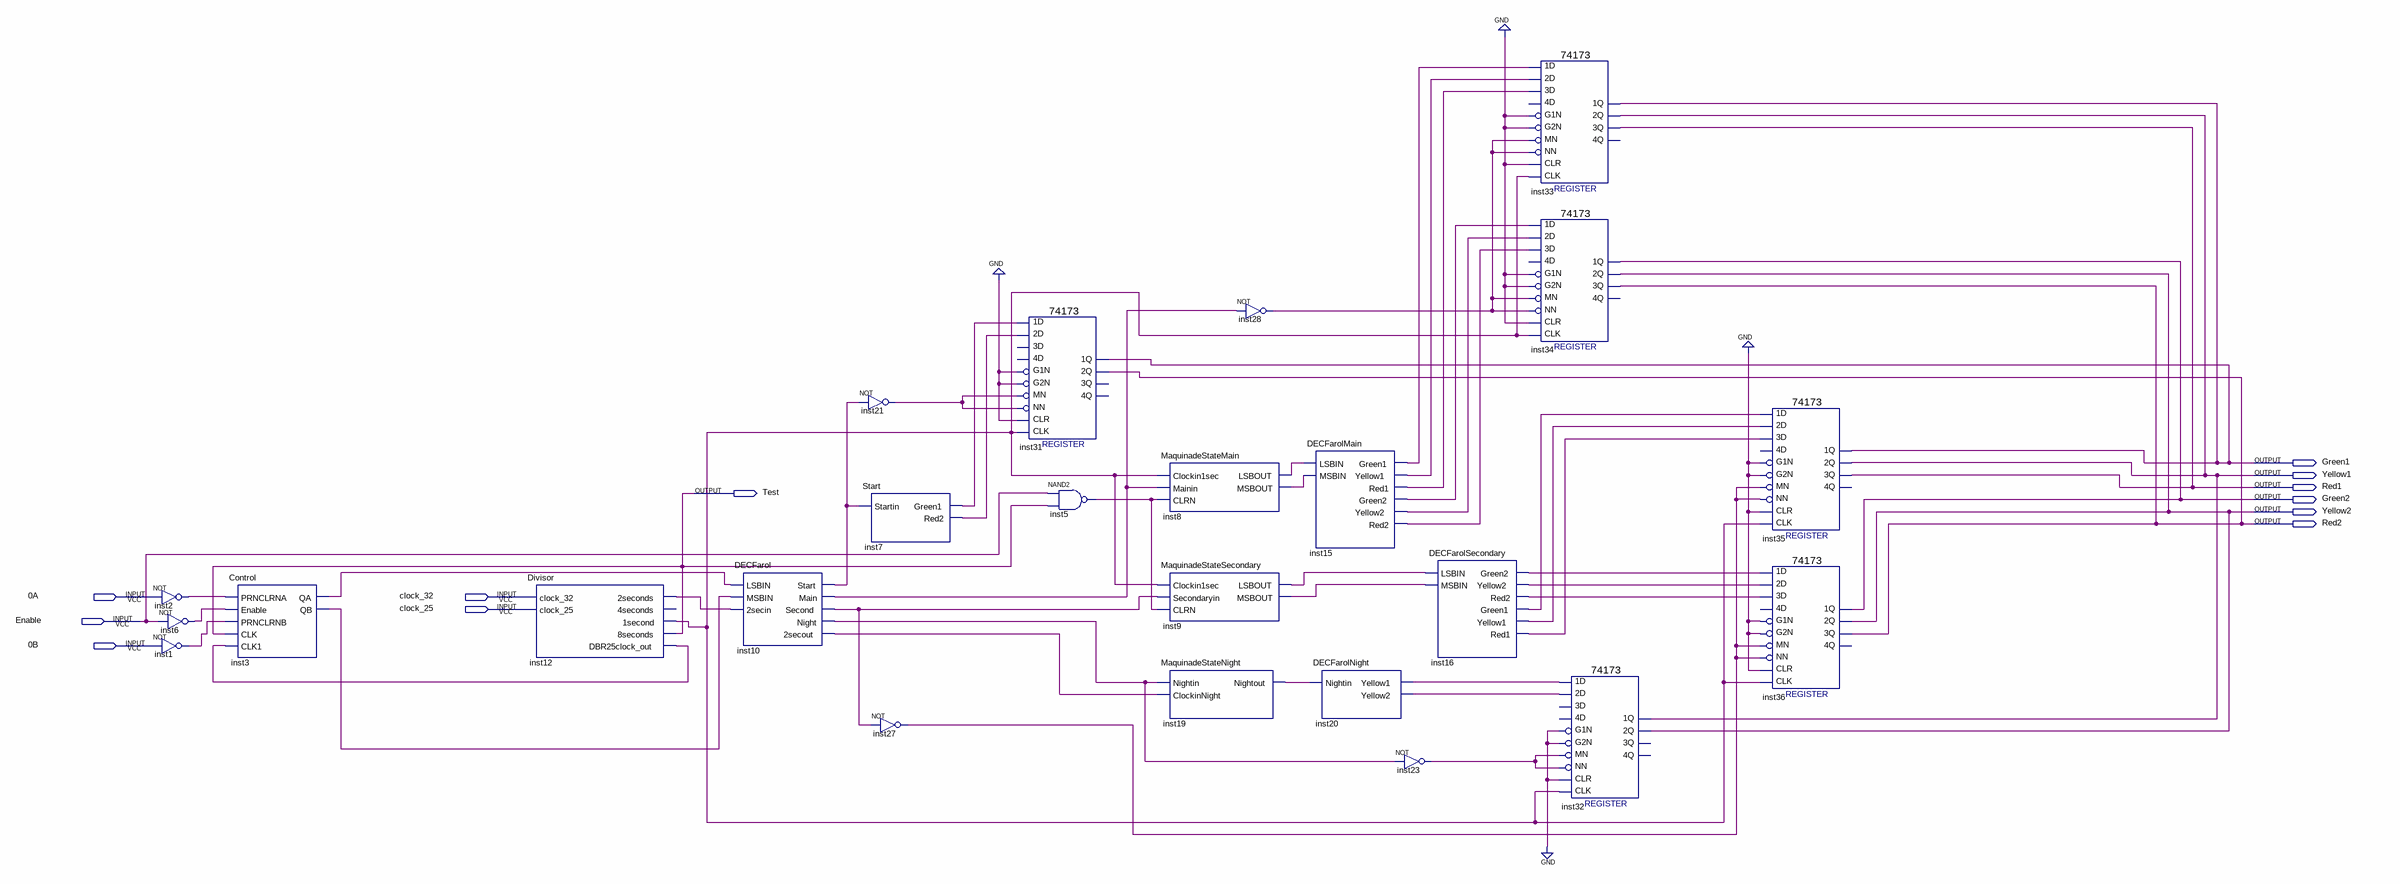
[diagram p0: schematic sheet]
// Quartus schematic SemaforoInteligente.bdf as structural Verilog: 24 symbols, 12 pins
module SemaforoInteligente (
  input  \0A ,
  input  clock_32,
  input  clock_25,
  input  Enable,
  input  \0B ,
  output Green1,
  output Yellow1,
  output Red1,
  output Test,
  output Green2,
  output Yellow2,
  output Red2
);

  wire inst1_out, inst2_out, inst3_qa, inst3_qb, inst5_out, inst6_out, inst7_green1, inst7_red2,
       inst8_lsbout, inst8_msbout, inst9_lsbout, inst9_msbout, inst10_2secout, inst10_main, inst10_night,
       inst10_second, inst10_start, inst12_1second, inst12_2seconds, inst12_dbr25clock_out, inst15_green1,
       inst15_green2, inst15_red1, inst15_red2, inst15_yellow1, inst15_yellow2, inst16_green1, inst16_green2,
       inst16_red1, inst16_red2, inst16_yellow1, inst16_yellow2, inst19_nightout, inst20_yellow1,
       inst20_yellow2, inst21_out, inst23_out, inst27_out, inst28_out;

  not inst2 (inst2_out, \0A );
  not inst6 (inst6_out, Enable);
  not inst1 (inst1_out, \0B );
  Control inst3 (
    .PRNCLRNA(inst2_out), .Enable(inst6_out), .PRNCLRNB(inst1_out), .CLK(Test), .CLK1(inst12_dbr25clock_out),
    .QA(inst3_qa), .QB(inst3_qb));
  Divisor inst12 (
    .clock_32(clock_32), .clock_25(clock_25), .\2seconds (inst12_2seconds), .\1second (inst12_1second),
    .\8seconds (Test), .DBR25clock_out(inst12_dbr25clock_out));  // open: 4seconds
  DECFarol inst10 (
    .LSBIN(inst3_qa), .MSBIN(inst3_qb), .\2secin (inst12_2seconds), .Start(inst10_start), .Main(inst10_main),
    .Second(inst10_second), .Night(inst10_night), .\2secout (inst10_2secout));
  not inst21 (inst21_out, inst10_start);
  Start inst7 (.Startin(inst10_start), .Green1(inst7_green1), .Red2(inst7_red2));
  not inst27 (inst27_out, inst10_second);
  \74173  inst31 (
    .MN(inst21_out), .\1D (inst7_green1), .\2D (inst7_red2), .G1N(1'b0), .G2N(1'b0), .NN(inst21_out),
    .CLR(1'b0), .CLK(inst12_1second), .\2Q (Red2), .\1Q (Green1));  // open: 3D, 4D, 3Q, 4Q
  nand inst5 (inst5_out, Enable, Test);
  MaquinadeStateMain inst8 (
    .Clockin1sec(inst12_1second), .Mainin(inst10_main), .CLRN(inst5_out), .LSBOUT(inst8_lsbout),
    .MSBOUT(inst8_msbout));
  MaquinadeStateSecondary inst9 (
    .Clockin1sec(inst12_1second), .Secondaryin(inst10_second), .CLRN(inst5_out), .LSBOUT(inst9_lsbout),
    .MSBOUT(inst9_msbout));
  MaquinadeStateNight inst19 (.Nightin(inst10_night), .ClockinNight(inst10_2secout), .Nightout(inst19_nightout));
  not inst28 (inst28_out, inst10_main);
  DECFarolMain inst15 (
    .LSBIN(inst8_lsbout), .MSBIN(inst8_msbout), .Green1(inst15_green1), .Yellow1(inst15_yellow1),
    .Red1(inst15_red1), .Green2(inst15_green2), .Yellow2(inst15_yellow2), .Red2(inst15_red2));
  DECFarolNight inst20 (.Nightin(inst19_nightout), .Yellow1(inst20_yellow1), .Yellow2(inst20_yellow2));
  not inst23 (inst23_out, inst10_night);
  DECFarolSecondary inst16 (
    .LSBIN(inst9_lsbout), .MSBIN(inst9_msbout), .Green2(inst16_green2), .Yellow2(inst16_yellow2),
    .Red2(inst16_red2), .Green1(inst16_green1), .Yellow1(inst16_yellow1), .Red1(inst16_red1));
  \74173  inst33 (
    .\3D (inst15_red1), .MN(inst28_out), .\1D (inst15_green1), .\2D (inst15_yellow1), .G1N(1'b0), .G2N(1'b0),
    .NN(inst28_out), .CLR(1'b0), .CLK(inst12_1second), .\3Q (Red1), .\2Q (Yellow1), .\1Q (Green1));  // open: 4D, 4Q
  \74173  inst34 (
    .\3D (inst15_red2), .MN(inst28_out), .\1D (inst15_green2), .\2D (inst15_yellow2), .G1N(1'b0), .G2N(1'b0),
    .NN(inst28_out), .CLR(1'b0), .CLK(inst12_1second), .\3Q (Red2), .\2Q (Yellow2), .\1Q (Green2));  // open: 4D, 4Q
  \74173  inst32 (
    .MN(inst23_out), .\1D (inst20_yellow1), .\2D (inst20_yellow2), .G1N(1'b0), .G2N(1'b0), .NN(inst23_out),
    .CLR(1'b0), .CLK(inst12_1second), .\2Q (Yellow2), .\1Q (Yellow1));  // open: 3D, 4D, 3Q, 4Q
  \74173  inst35 (
    .\3D (inst16_red1), .MN(inst27_out), .\1D (inst16_green1), .\2D (inst16_yellow1), .G1N(1'b0), .G2N(1'b0),
    .NN(inst27_out), .CLR(1'b0), .CLK(inst12_1second), .\3Q (Red1), .\2Q (Yellow1), .\1Q (Green1));  // open: 4D, 4Q
  \74173  inst36 (
    .\3D (inst16_red2), .MN(inst27_out), .\1D (inst16_green2), .\2D (inst16_yellow2), .G1N(1'b0), .G2N(1'b0),
    .NN(inst27_out), .CLR(1'b0), .CLK(inst12_1second), .\3Q (Red2), .\2Q (Yellow2), .\1Q (Green2));  // open: 4D, 4Q
endmodule
